# EAGLE design Modul1 (EAGLE 9.6.2)
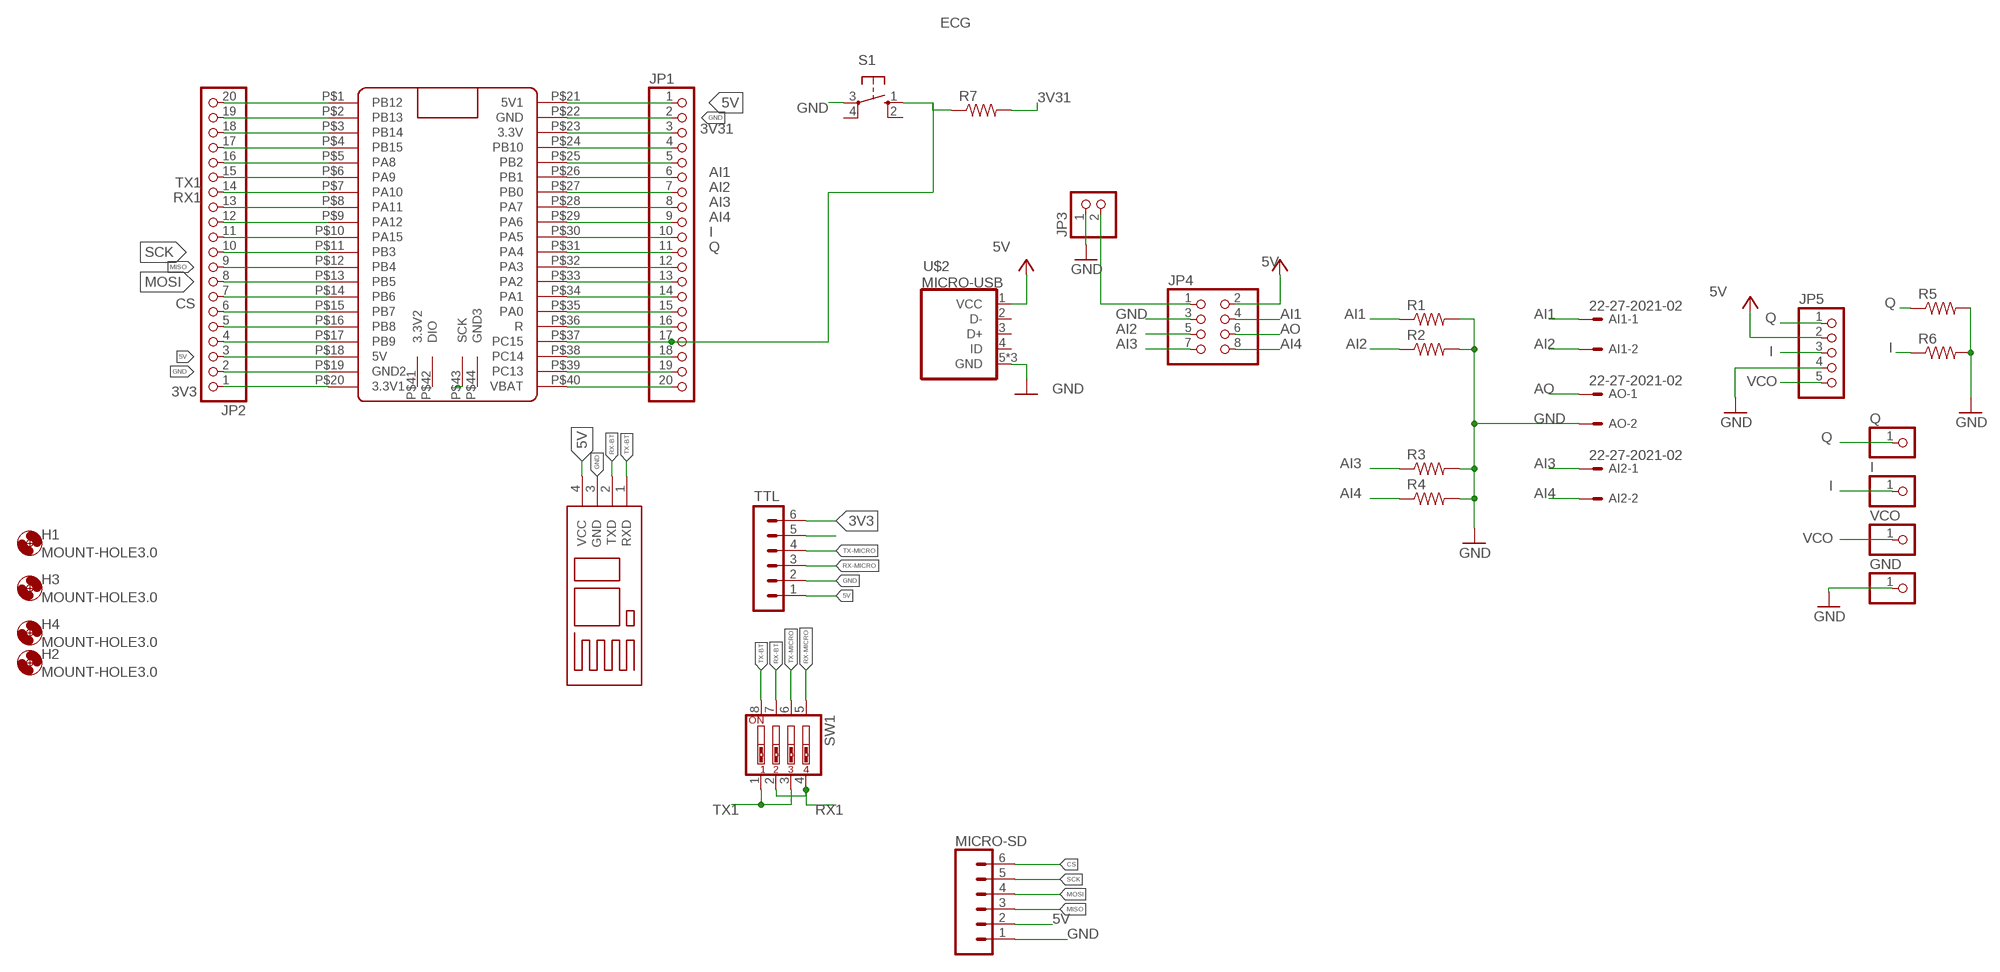
[diagram p0: schematic, sheet 1]

## Parts
AI1  22-27-2021-02  [6410-02]
AI2  22-27-2021-02  [6410-02]
AO  22-27-2021-02  [6410-02]
B3  BLUETOOTH  [BLUETOOTH]
GND  PINHD-1X1  [1X01]
H1  MOUNT-HOLE3.0  [3,0]
H2  MOUNT-HOLE3.0  [3,0]
H3  MOUNT-HOLE3.0  [3,0]
H4  MOUNT-HOLE3.0  [3,0]
I  PINHD-1X1  [1X01]
JP1  PINHD-1X20  [1X20]
JP2  PINHD-1X20  [1X20]
JP3  PINHD-1X2  [1X02]
JP4  PINHD-2X4  [2X04]
JP5  PINHD-1X5  [1X05]
MICRO-SD  CONN_06SILK_FEMALE_PTH  [1X06@1]
Q  PINHD-1X1  [1X01]
R1  R-US_0207/12  [0207/12]
R2  R-US_0207/12  [0207/12]
R3  R-US_0207/12  [0207/12]
R4  R-US_0207/12  [0207/12]
R5  R-US_0207/12  [0207/12]
R6  R-US_0207/12  [0207/12]
R7  R-US_0207/12  [0207/12]
S1  10-XX  [B3F-10XX]
SW1  SW_DIP-4  [EDG-04]
TTL  MA06-1  [MA06-1]
U$1  BLACKPILL  [BLACKPILL]
U$2  MICRO-USB  [MICRO-USB]
VCO  PINHD-1X1  [1X01]

## Nets
3V3: JP2.1 TTL.6 U$1.P$20(3.3V1)
3V31: JP1.3 R7.2 U$1.P$23(3.3V)
5V: B3.4(VCC) JP1.1 JP2.3 JP4.2 JP5.2 MICRO-SD.2 TTL.1 U$1.P$18(5V) U$1.P$21(5V1) U$2.1(VCC) ; supply symbol labelled VCC
AI1: AI1.1 JP1.6 JP4.4 R1.1 U$1.P$26(PB1)
AI2: AI1.2 JP1.7 JP4.5 R2.1 U$1.P$27(PB0)
AI3: AI2.1 JP1.8 JP4.7 R3.1 U$1.P$28(PA7)
AI4: AI2.2 JP1.9 JP4.8 R4.1 U$1.P$29(PA6)
AO: AO.1 JP4.6
CS: JP2.7 MICRO-SD.6 U$1.P$14(PB6)
ECG: JP1.14 U$1.P$34(PA1)
GND: AO.2 GND.1 JP1.2 JP2.2 JP3.1 JP4.3 JP5.4 MICRO-SD.1 R1.2 R2.2 R3.2 R4.2 R5.2 R6.2 S1.3(P) TTL.2 U$1.P$19(GND2) U$1.P$22(GND) U$2.5(GND) U$2.GND1(GND) U$2.GND2(GND)
I: I.1 JP1.10 JP5.3 R6.1 U$1.P$30(PA5)
MISO: JP2.9 MICRO-SD.3 U$1.P$12(PB4)
MOSI: JP2.8 MICRO-SD.4 U$1.P$13(PB5)
N$1: JP2.20 U$1.P$1(PB12)
N$2: JP2.19 U$1.P$2(PB13)
N$3: JP2.18 U$1.P$3(PB14)
N$4: JP3.2 JP4.1
N$5: JP1.17 R7.1 S1.1(S) U$1.P$37(PC15)
N$6: TTL.5
N$7: JP1.4 U$1.P$24(PB10)
N$8: JP2.11 U$1.P$10(PA15)
N$9: JP2.12 U$1.P$9(PA12)
N$16: JP2.5 U$1.P$16(PB8)
N$21: JP1.20 U$1.P$40(VBAT)
N$22: JP1.19 U$1.P$39(PC13)
N$23: JP1.18 U$1.P$38(PC14)
N$25: JP1.16 U$1.P$36(R)
N$30: JP1.5 U$1.P$25(PB2)
N$40: JP1.15 U$1.P$35(PA0)
Q: JP1.11 JP5.1 Q.1 R5.1 U$1.P$31(PA4)
RX1: JP2.14 SW1.2 SW1.4 U$1.P$7(PA10)
RX2: JP1.12 U$1.P$32(PA3)
RX-BT: B3.2(TXD) SW1.7
RX-MICRO: SW1.5 TTL.3
SCK: JP2.10 MICRO-SD.5 U$1.P$11(PB3)
SDA: JP2.4 U$1.P$17(PB9)
SDIO_CK: JP2.17 U$1.P$4(PB15)
SDIO_D0: JP2.6 U$1.P$15(PB7)
SDIO_D1: JP2.16 U$1.P$5(PA8)
SWCK: U$1.P$43(SCK)
TX1: JP2.15 SW1.1 SW1.3 U$1.P$6(PA9)
TX2: JP1.13 U$1.P$33(PA2)
TX6: JP2.13 U$1.P$8(PA11)
TX-BT: B3.1(RXD) SW1.8
TX-MICRO: SW1.6 TTL.4
VCO: JP5.5 VCO.1
Unconnected: S1.2(S1) S1.4(P1) U$1.P$41(3.3V2) U$1.P$42(DIO) U$1.P$44(GND3) U$2.2(D-) U$2.3(D+) U$2.4(ID)

## Notes on the sheet
- ECG

## Power pins joined to a net without a drawn wire
GND: B3.3(GND)

## Library data of the parts
AI1 AI2 AO = con-molex:22-?-02: CONNECTOR wire to board 2.54 mm (.1 inch) pitch header; OC_FARNELL: unknown; OC_NEWARK: unknown
B3 = Bluetooth:BLUETOOTH
GND I Q VCO = pinhead:PINHD-1X1: PIN HEADER
H1-H4 = holes:MOUNT-HOLE: MOUNTING HOLE with drill center marker
JP1 JP2 = pinhead:PINHD-1X20: PIN HEADER
JP3 = pinhead:PINHD-1X2: PIN HEADER
JP4 = pinhead:PINHD-2X4: PIN HEADER
JP5 = pinhead:PINHD-1X5: PIN HEADER
MICRO-SD = SparkFun-Connectors:CONN_06: Multi connection point. Often used as Generic Header-pin footprint for 0.1 inch spaced/style header connections On any of the 0.1 inch spaced packages, you can populate with these: Break Away Headers - Straight <https://www.sparkfun.com/products/116> (PRT-00116) Break Away Male Headers - Right Angle <https://www.sparkfun.com/products/553> (PRT-00553) Female Headers <https://www.sparkfun.com/products/115> (PRT-00115) Break Away Headers - Machine Pin <https://www.sparkfun.com/products/117> (PRT-00117) Break Away Female Headers - Swiss Machine Pin <https://www.sparkfun.com/products/743> (PRT-00743) Arduino Stackable Header - 6 Pin <https://www.sparkfun.com/products/9280> (PRT-09280) For SCREWTERMINALS and SPRING TERMINALS visit here: Screw Terimnals on SparkFun.com <https://www.sparkfun.com/search/results?term=Screw+Terminals> (5mm/3.5mm/2.54mm spacing) This device is also useful as a general connection point to wire up your design to another part of your project. Our various solder wires solder well into these plated through hole pads. Hook-Up Wire - Assortment (Stranded, 22 AWG) <https://www.sparkfun.com/products/11375> (PRT-11375) Hook-Up Wire - Assortment (Solid Core, 22 AWG) <https://www.sparkfun.com/products/11367> (PRT-11367) View the entire wire category on our website here <https://www.sparkfun.com/categories/141>; PROD_ID: CONN-08437
R1-R7 = rcl:R-US_: RESISTOR, American symbol
S1 = switch-omron:10-XX: OMRON SWITCH; MPN: B3F-1000; OC_FARNELL: 176432; OC_NEWARK: 36M3542
SW1 = special:SW_DIP-4: DIP SWITCH
TTL = con-lstb:MA06-1: PIN HEADER; OC_FARNELL: unknown; OC_NEWARK: unknown
U$1 = BluePill:BLACKPILL
U$2 = microusb:MICRO-USB: Micro USB B connector

## Net classes
0 default: width 0.406 mm, drill 0.8 mm, clearance 0.008 mm

## Board
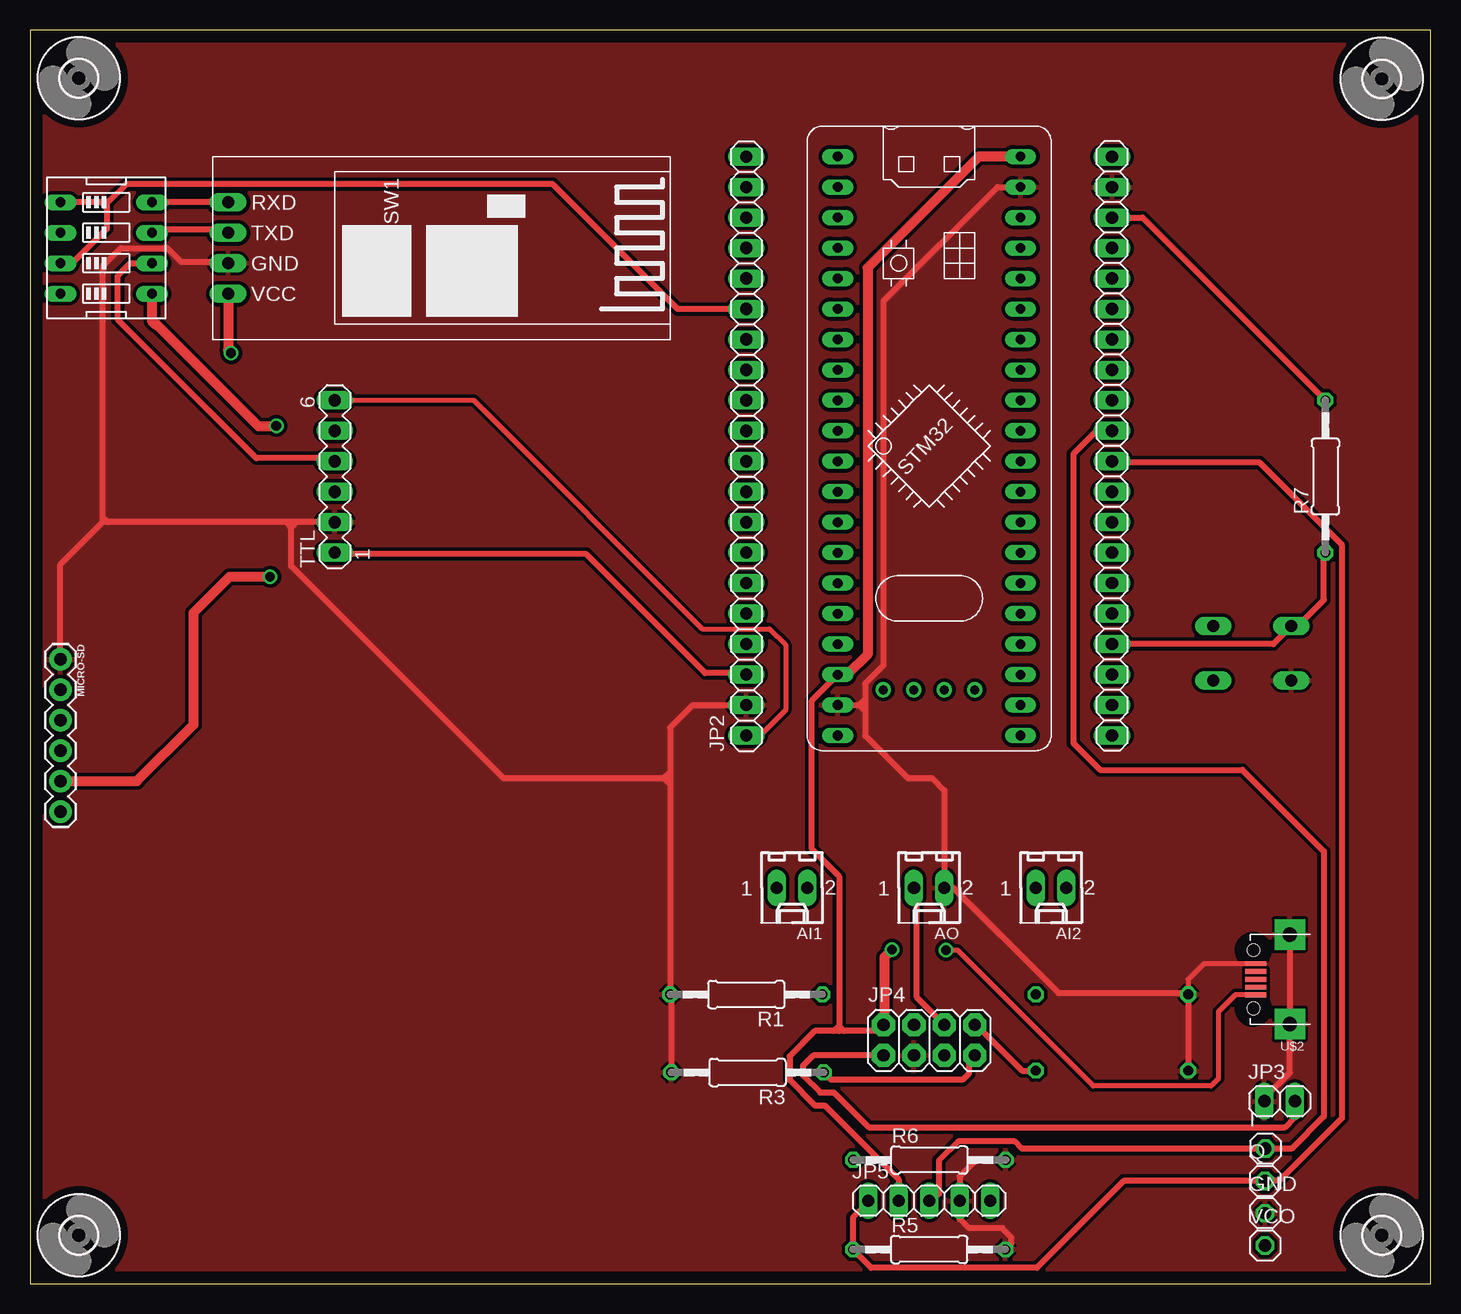
[diagram p1: board, top side]
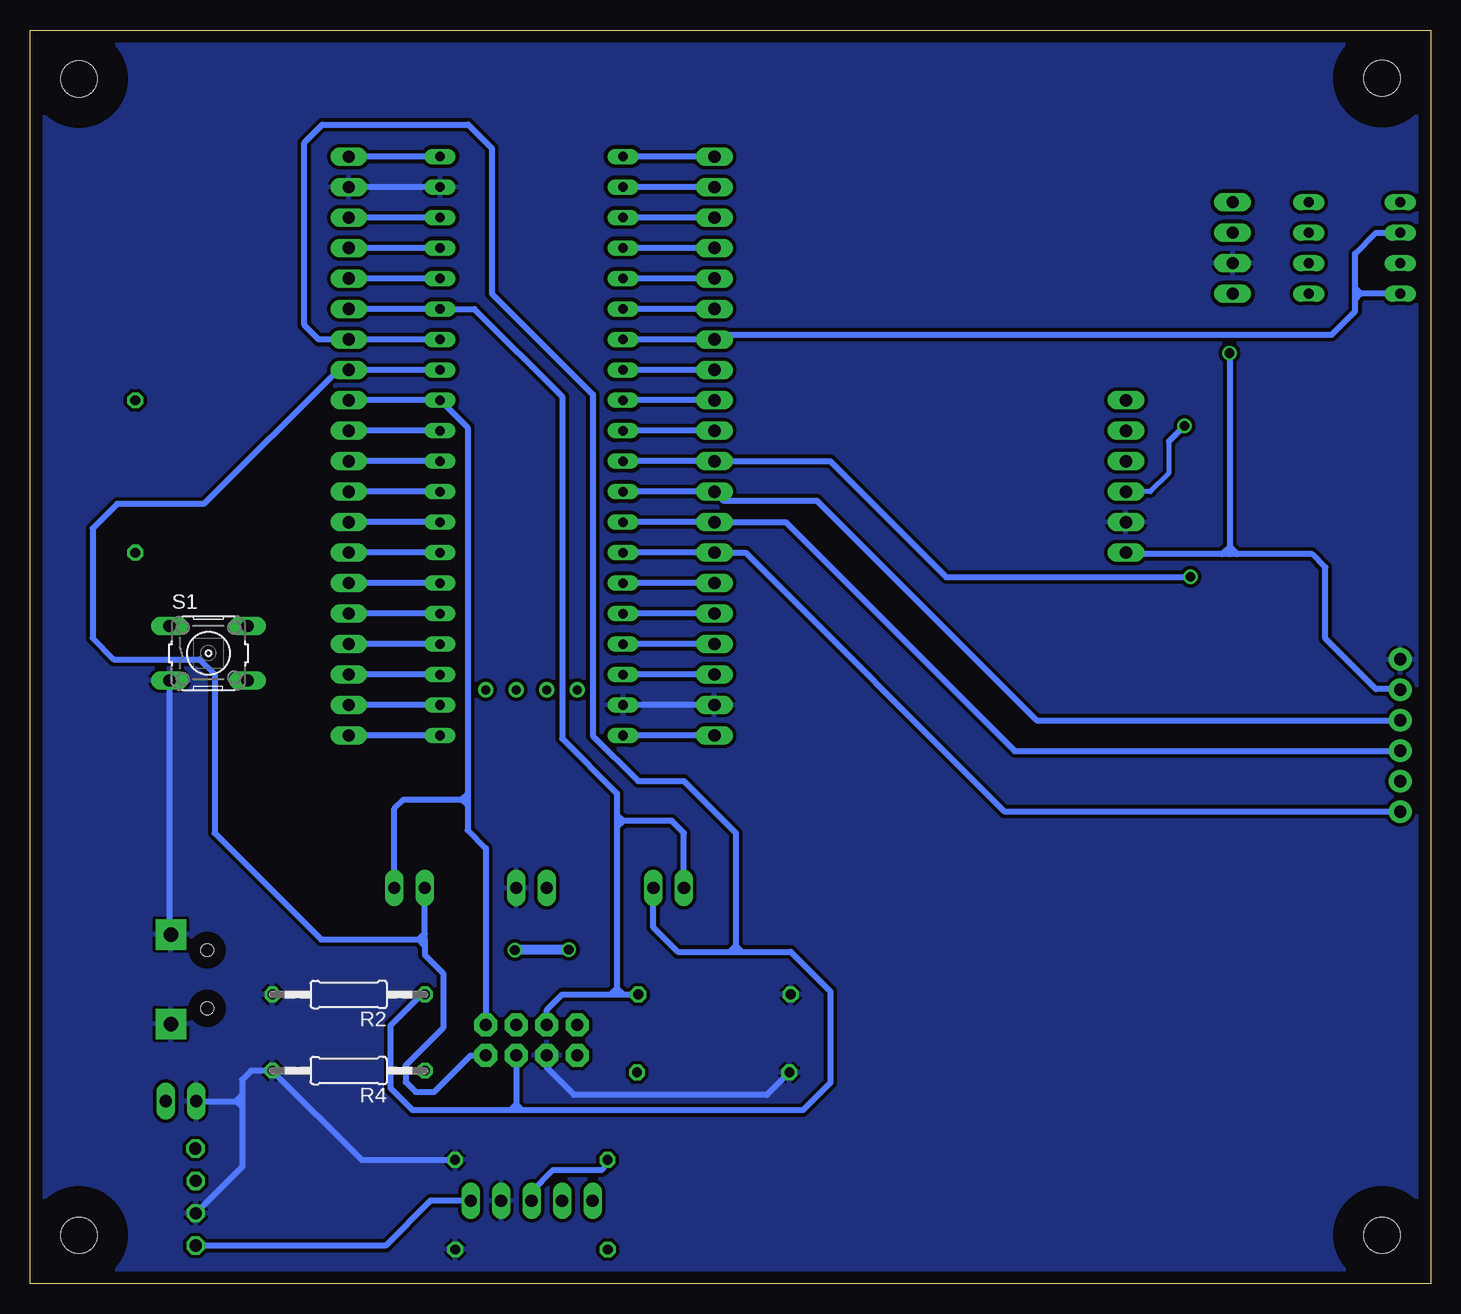
[diagram p2: board, bottom side, seen from below]

Size 116.73 x 104.53 mm. Coordinates in mm from the lower left corner, seen from the top.
Outline: 0,0 116.73,0 116.72,104.53 0,104.53 0,0
Copper layers (1*16): Top 0.035mm / dielectric 1.5mm / Bottom 0.035mm
Design rules "default *": minimum track width 10mil, minimum drill 0.6mm, track to track 0.3mm, track to pad 0.3mm, pad to pad 0.3mm, via to via 0.3mm, smd to smd 0.3mm, copper to edge 40mil, drill to drill 6mil, minimum pad ring 10mil, minimum via ring 8mil, stop-mask expansion 4mil, vias tented up to drill 0mil, thermal gap 10mil

### Footprints (pad centres in the part's own frame; a part is rotated, then mirrored left to right if it is on the bottom)
6410-02 = drill 1.016 long: 1 1.27,0; 2 -1.27,0
BLUETOOTH = drill 1 pad 1.549 long: 1 -6.35,3.81; 2 -6.35,1.27; 3 -6.35,-1.27; 4 -6.35,-3.81
1X01 = drill 1.016 octagon: 1 0,0
3,0 = hole 3: 0,0
1X20 = drill 1.016 long: 1 -24.13,0; 2 -21.59,0; 3 -19.05,0; 4 -16.51,0; 5 -13.97,0; 6 -11.43,0; 7 -8.89,0; 8 -6.35,0; 9 -3.81,0; 10 -1.27,0; 11 1.27,0; 12 3.81,0; 13 6.35,0; 14 8.89,0; 15 11.43,0; 16 13.97,0; 17 16.51,0; 18 19.05,0; 19 21.59,0; 20 24.13,0
1X02 = drill 1.016 long: 1 -1.27,0; 2 1.27,0
2X04 = drill 1.016 pad 1.93 octagon: 1 -3.81,-1.27; 2 -3.81,1.27; 3 -1.27,-1.27; 4 -1.27,1.27; 5 1.27,-1.27; 6 1.27,1.27; 7 3.81,-1.27; 8 3.81,1.27
1X05 = drill 1.016 long: 1 -5.08,0; 2 -2.54,0; 3 0,0; 4 2.54,0; 5 5.08,0
1X06@1 = drill 1.016 pad 1.88: 1 0,0; 2 2.54,0; 3 5.08,0; 4 7.62,0; 5 10.16,0; 6 12.7,0
0207/12 = drill 0.813 octagon: 1 -6.35,0; 2 6.35,0
B3F-10XX = drill 1.016 long: 1 -3.251,2.261; 2 3.251,2.261; 3 -3.251,-2.261; 4 3.251,-2.261
EDG-04 = drill 0.813 long: 1 -3.81,-3.81; 2 -1.27,-3.81; 3 1.27,-3.81; 4 3.81,-3.81; 5 3.81,3.81; 6 1.27,3.81; 7 -1.27,3.81; 8 -3.81,3.81
MA06-1 = drill 1.016 long: 1 -6.35,0; 2 -3.81,0; 3 -1.27,0; 4 1.27,0; 5 3.81,0; 6 6.35,0
BLACKPILL = drill 0.8 long: P$1 -7.62,15.24; P$2 -7.62,12.7; P$3 -7.62,10.16; P$4 -7.62,7.62; P$5 -7.62,5.08; P$6 -7.62,2.54; P$7 -7.62,0; P$8 -7.62,-2.54; P$9 -7.62,-5.08; P$10 -7.62,-7.62; P$11 -7.62,-10.16; P$12 -7.62,-12.7; P$13 -7.62,-15.24; P$14 -7.62,-17.78; P$15 -7.62,-20.32; P$16 -7.62,-22.86; P$17 -7.62,-25.4; P$18 -7.62,-27.94; P$19 -7.62,-30.48; P$20 -7.62,-33.02; P$21 7.62,15.24; P$22 7.62,12.7; P$23 7.62,10.16; P$24 7.62,7.62; P$25 7.62,5.08; P$26 7.62,2.54; P$27 7.62,0; P$28 7.62,-2.54; P$29 7.62,-5.08; P$30 7.62,-7.62; P$31 7.62,-10.16; P$32 7.62,-12.7; P$33 7.62,-15.24; P$34 7.62,-17.78; P$35 7.62,-20.32; P$36 7.62,-22.86; P$37 7.62,-25.4; P$38 7.62,-27.94; P$39 7.62,-30.48; P$40 7.62,-33.02 | drill 0.75: P$41 -3.81,-29.21; P$42 -1.27,-29.21; P$43 1.27,-29.21; P$44 3.81,-29.21
MICRO-USB = smd 0.4 x 1.75: 1 -1.3,4.525; 2 -0.65,4.525; 3 0,4.525; 4 0.65,4.525; 5 1.3,4.525 | drill 1.2 pad 2.54 square: GND1 -3.725,1.7; GND2 3.725,1.7 | hole 1.05: -2.425,4.73; 2.425,4.73

### Placement (x,y rotation side)
AI1  63.5,33.02 180 top
AI2  85.09,33.02 180 top
AO  74.93,33.02 180 top
B3  22.86,86.36 0 top
GND  102.92,5.89 0 top
H1  4.06,4.06 0 top
H2  4.06,100.51 0 top
H3  112.65,4.06 0 top
H4  112.65,100.46 0 top
I  102.95,11.28 0 top
JP1  90.17,69.85 270 top
JP2  59.69,69.85 90 top
JP3  104.14,15.24 0 top
JP4  74.93,20.32 0 top
JP5  74.93,6.93 0 top
MICRO-SD  2.54,52.07 270 top
Q  102.92,8.59 0 top
R1  59.69,24.13 180 top
R2  90.17,24.13 180 bottom
R3  59.79,17.63 180 top
R4  90.17,17.78 180 bottom
R5  74.93,2.87 0 top
R6  74.96,10.34 0 top
R7  107.95,67.31 90 top
S1  101.85,52.58 0 bottom
SW1  6.35,86.36 270 top
TTL  25.4,67.31 90 top
U$1  74.93,78.74 0 top
U$2  106.68,25.4 90 top
VCO  102.92,3.2 0 top

### Tracks (layer width: path | path; a pad name or v marks a point on that pad's centre or on a via)
3V3
  Top 0.406: TTL.6 36.98,73.66 56.03,54.61 61.65,54.61 62.97,53.29 62.97,47.83 60.86,45.72 JP2.1
  Bottom 0.508: JP2.1 U$1.P$20
3V31
  Top 0.508: JP1.3 92.71,88.9 R7.2
  Bottom 0.508: U$1.P$23 JP1.3
5V  (via drill 0.8)
  Top 0.406: 67.44,21.46 67.33,21.46 66.95,21.08 | U$2.1 100.45,24.1 99.06,22.71 99.06,17.14 98.42,16.51 88.59,16.51 77.29,27.81 v76.33,27.81
  Top 0.508: JP5.2 72.39,8.71 66.22,14.88 65.41,14.88 63.3,16.99 63.3,18.97 65.41,21.08 66.95,21.08 67.44,21.08 | JP4.2 70.61,21.08 67.82,21.08 | 67.82,21.08 67.44,21.08 | U$1.P$18 65.15,48.64 65.15,36.25 67.44,33.96 67.44,21.46 | 67.44,21.08 67.44,21.46 | TTL.1 25.53,60.83 46.35,60.83 56.26,50.93 59.44,50.93 JP2.3 | 67.82,21.08 67.44,21.46
  Top 0.813: B3.4 16.51,77.85 v16.76,77.6 | U$1.P$21 79.07,93.98 69.8,84.71 69.8,52.48 68.12,50.8 U$1.P$18 | v71.83,27.86 71.2,27.23 71.2,21.67 JP4.2
  Bottom 0.508: JP2.3 U$1.P$18 | U$1.P$21 JP1.1 | 16.13,60.83 16.76,60.83 | 16.76,60.83 17.4,60.83 | 17.4,60.83 25.15,60.83 TTL.1 | MICRO-SD.2 2.59,49.58 4.57,49.58 8.79,53.8 8.79,59.74 9.88,60.83 16.13,60.83 | 16.76,60.83 16.76,61.47 | v16.76,77.6 16.76,61.47 | 16.76,61.47 17.4,60.83 | 16.76,61.47 16.13,60.83
  Bottom 0.813: v71.83,27.86 76.28,27.86 v76.33,27.81
AI1
  Bottom 0.508: JP1.6 U$1.P$26 79.7,81.28 72.39,73.97 72.39,45.47 67.82,40.89 67.82,39.12 | JP4.4 73.66,22.86 72.39,24.13 68.33,24.13 | 68.33,24.13 67.82,24.13 | 67.82,24.13 67.31,24.13 | 67.31,24.13 R1.1 | 67.82,39.12 67.82,38.61 | 67.82,38.61 67.82,38.1 | 67.82,38.1 67.82,24.64 | AI1.1 62.23,37.59 63.25,38.61 67.31,38.61 | 67.31,38.61 67.82,38.61 | 67.82,39.12 67.31,38.61 | 67.31,38.61 67.82,38.1 | 67.82,24.13 67.82,24.64 | 67.82,24.64 68.33,24.13 | 67.82,24.64 67.31,24.13
AI2
  Bottom 0.508: U$1.P$27 JP1.7 92.66,78.74 93.85,79.93 93.85,95.15 92.35,96.65 80.21,96.65 78.23,94.67 78.23,82.55 69.83,74.14 69.83,45.7 66.04,41.91 62.23,41.91 57.91,37.59 57.91,28.19 | JP4.5 76.2,14.99 | 76.2,14.48 76.2,14.99 | 76.2,14.48 76.71,14.48 | 76.71,14.48 84.84,14.48 86.67,16.31 86.67,21.54 84.07,24.13 R2.1 | 57.91,28.19 57.91,27.69 | AI1.2 64.77,29.72 62.74,27.69 58.42,27.69 | 58.42,27.69 57.91,27.69 | 57.91,27.69 57.4,27.69 | 57.4,27.69 53.34,27.69 50.04,24.38 50.04,16.76 52.32,14.48 75.69,14.48 | 75.69,14.48 76.2,14.48 | 76.2,14.99 76.71,14.48 | 76.2,14.99 75.69,14.48 | 57.91,28.19 57.4,27.69 | 57.91,28.19 58.42,27.69
AI3
  Top 0.508: JP4.7 78.23,18.54 78.23,17.53 77.72,17.02 66.75,17.02 R3.1
  Bottom 0.508: U$1.P$28 JP1.8 91.05,76.2 102.23,65.02 109.47,65.02 111.51,62.99 111.51,53.85 109.73,52.07 102.62,52.07 101.35,50.8 101.35,37.59 92.46,28.7 84.33,28.7 | 83.82,28.7 83.82,29.21 | 83.82,29.21 AI2.1 | JP4.7 80.01,19.05 83.06,16 84.58,16 85.42,16.84 85.42,18.21 82.3,21.34 82.3,25.91 83.82,27.43 83.82,28.19 | 83.82,28.7 83.82,28.19 | 84.33,28.7 83.82,28.7 | 84.33,28.7 83.82,29.21 | 84.33,28.7 83.82,28.19
AI4
  Top 0.508: R4.1 82.68,17.78 78.87,21.59 JP4.8
  Bottom 0.508: JP1.9 U$1.P$29 80.26,71.37 80.26,40.89 | 80.26,40.89 80.26,40.39 | 80.26,40.39 80.26,39.88 | 80.26,39.88 80.26,37.85 78.74,36.32 JP4.8 | 80.77,40.39 85.6,40.39 86.36,39.62 AI2.2 | 80.77,40.39 80.26,40.39 | 80.26,40.89 80.77,40.39 | 80.77,40.39 80.26,39.88
AO
  Top 0.508: JP4.6 73.91,23.88 73.91,33.02 AO.1
CS
  Bottom 0.508: U$1.P$14 JP2.7 57.1,60.96 35.53,39.39 2.56,39.39 MICRO-SD.6
ECG
  Bottom 0.508: U$1.P$34 JP1.14
GND
  Top 0.406: U$2.5 97.82,26.7 96.52,25.4 R2.2
  Top 0.508: JP3.1 102.87,15.49 104.98,17.6 U$2.GND1 U$2.GND2 | B3.3 16.38,85.22 12.57,85.22 11.43,86.36 7.57,86.36 6.07,84.86 6.07,63.91 | R3.2 53.44,24.03 R1.2 53.34,41.66 | 76.2,33.78 76.2,41.15 75.18,42.16 73.15,42.16 69.6,45.72 69.6,47.75 | U$1.P$22 80.64,91.44 71.12,81.92 71.12,51.56 69.6,50.04 69.6,48.77 | 53.34,42.16 53.34,41.66 | 53.34,42.67 53.34,46.38 55.22,48.26 JP2.2 | 53.34,42.67 53.34,42.16 | 21.77,63.07 21.77,59.84 39.45,42.16 52.83,42.16 | 21.77,63.07 21.77,63.5 | 53.34,42.16 52.83,42.16 | 76.2,33.78 85.72,24.26 96.39,24.26 R2.2 R4.2 | 76.2,33.78 AO.2 | R6.2 78.84,10.34 77.47,8.97 JP5.4 77.47,5.41 78.23,4.65 81.03,4.65 81.79,3.89 81.79,3.38 R5.2 | 52.83,42.16 53.34,41.66 | 69.6,48.77 69.6,48.26 | 69.6,48.26 69.6,47.75 | U$1.P$19 69.09,48.26 | 69.6,48.26 69.09,48.26 | 69.09,48.26 69.6,48.77 | 69.09,48.26 69.6,47.75 | TTL.2 22.2,63.5 | 22.2,63.5 21.77,63.5 | 21.77,63.5 21.34,63.5 | 21.34,63.5 6.48,63.5 | 6.48,63.5 6.07,63.5 | 6.07,63.5 6.07,63.91 | 6.07,63.5 2.54,59.97 MICRO-SD.1 | 6.07,63.91 6.48,63.5 | 21.34,63.5 21.77,63.07 | 21.77,63.07 22.2,63.5 | 52.83,42.16 53.34,42.67
  Bottom 0.508: JP2.2 U$1.P$19 | U$1.P$22 JP1.2 | GND.1 99.06,9.75 99.06,14.73 | JP4.3 73.66,18.03 71.37,15.75 55.32,15.75 R3.2 | 99.06,15.75 99.06,17.02 98.3,17.78 R4.2 89.08,10.34 R6.2 | 99.06,15.75 99.06,15.24 | 99.06,15.24 99.06,14.73 | JP3.1 99.57,15.24 | 99.57,15.24 99.06,15.24 | 99.06,15.75 99.57,15.24 | 99.57,15.24 99.06,14.73 | S1.3 105.11,29.25 U$2.GND2
  pour Bottom: -1.78,106.17 -1.78,-1.78 120.14,-1.78 120.14,106.68 119.89,106.93 -1.78,106.93 -1.78,106.43
  pour Top: -1.52,105.92 -1.52,-1.78 119.13,-1.78 119.13,106.43 -1.52,106.43
I
  Top 0.508: JP1.10 88.9,71.12 86.94,69.16 86.94,45.09 89.18,42.85 101.04,42.85 107.82,36.07 107.82,13.97 105.13,11.28 I.1 82.65,11.28 82.04,11.89 77.34,11.89 75.74,10.29 75.74,7.49 75.18,6.93 JP5.3
  Bottom 0.508: U$1.P$30 JP1.10 | R6.1 68.61,9.96 69.09,9.47 73.15,9.47 74.93,7.7 JP5.3
MISO
  Bottom 0.508: U$1.P$12 JP2.9 58.95,65.3 51.16,65.3 32.84,46.99 MICRO-SD.3
MOSI
  Bottom 0.508: U$1.P$13 JP2.8 53.75,63.5 34.67,44.42 2.56,44.42 MICRO-SD.4
N$1
  Bottom 0.508: JP2.20 U$1.P$1
N$2
  Bottom 0.508: JP2.19 U$1.P$2
N$3
  Bottom 0.508: JP2.18 U$1.P$3
N$4
  Top 0.508: JP3.2 105.41,13.87 104.6,13.06 69.88,13.06 66.98,15.95 65.84,15.95 64.41,17.37 64.41,18.19 65.28,19.05 JP4.1
N$5
  Top 0.508: R7.1 107.82,60.83 107.82,57.02 105.69,54.89 S1.1 103.61,53.34 JP1.17
  Bottom 0.508: U$1.P$37 JP1.17
N$7
  Bottom 0.508: U$1.P$24 JP1.4
N$8
  Bottom 0.508: JP2.11 U$1.P$10
N$9
  Bottom 0.508: JP2.12 U$1.P$9
N$16
  Bottom 0.508: JP2.5 U$1.P$16
N$21
  Bottom 0.508: U$1.P$40 JP1.20
N$22
  Bottom 0.508: U$1.P$39 JP1.19
N$23
  Bottom 0.508: U$1.P$38 JP1.18
N$25
  Bottom 0.508: U$1.P$36 JP1.16
N$30
  Bottom 0.508: U$1.P$25 JP1.5
N$40
  Bottom 0.508: U$1.P$35 JP1.15
Q
  Top 0.508: JP5.1 69.72,6.68 68.58,5.54 R5.1 70.1,1.35 83.9,1.35 91.14,8.59 Q.1 104.09,8.59 109.35,13.84 109.35,61.59 102.49,68.45 90.3,68.45 JP1.11
  Bottom 0.508: U$1.P$31 JP1.11
RX1
  Bottom 0.508: U$1.P$7 JP2.14 59.44,78.74 59.05,79.12 8.26,79.12 6.3,81.08 6.3,82.07 | 6.3,82.07 6.3,82.45 | 6.3,82.45 6.3,83.03 | 6.3,83.03 6.3,85.9 4.57,87.63 SW1.2 | SW1.4 5.82,82.55 | 5.82,82.55 6.2,82.55 6.3,82.45 | 5.82,82.55 6.3,83.03 | 5.82,82.55 6.3,82.07
RX2
  Bottom 0.508: U$1.P$32 JP1.12
RX-BT
  Top 0.508: SW1.7 10.29,87.88 16.38,87.88 B3.2
RX-MICRO  (via drill 0.8)
  Top 0.813: SW1.5 10.16,80.26 10.49,79.93 10.49,80.03 19.02,71.5 20.5,71.5 v20.52,71.53
  Bottom 0.406: 21.79,70.26 21.84,70.21 21.84,67.56 23.37,66.04 TTL.3
  Bottom 0.508: v20.52,71.53 21.79,70.26
SCK  (via drill 0.8)
  Top 0.813: MICRO-SD.5 8.91,41.91 13.64,46.63 13.64,55.96 16.64,58.95 v20.02,58.95
  Bottom 0.508: U$1.P$11 JP2.10 50.04,68.58 40.39,58.93 20.02,58.93 v20.02,58.95
SDA
  Bottom 0.508: JP2.4 U$1.P$17
SDIO_CK
  Bottom 0.508: JP2.17 U$1.P$4
SDIO_D0
  Bottom 0.508: JP2.6 U$1.P$15
SDIO_D1
  Bottom 0.508: JP2.16 U$1.P$5
TX1
  Top 0.508: 6.48,90.17 8,91.69 43.56,91.69 53.98,81.28 JP2.15 | 6.48,90.17 5.92,90.17 | 5.92,90.17 SW1.1 | 6.48,90.17 6.4,90.09 6.4,89.69 | 6.4,89.69 6.4,87.96 3.53,85.09 SW1.3 | 5.92,90.17 6.4,89.69
  Bottom 0.508: JP2.15 U$1.P$6
TX2
  Bottom 0.508: U$1.P$33 JP1.13
TX6
  Bottom 0.508: JP2.13 U$1.P$8
TX-BT
  Top 0.508: B3.1 SW1.8
TX-MICRO
  Top 0.508: TTL.4 25.15,68.83 18.87,68.83 7.32,80.39 7.32,84.05 8.36,85.09 SW1.6
VCO
  Bottom 0.508: VCO.1 87.1,3.2 83.36,6.93 JP5.5